# Altium schematic sheet SDCard.SchDoc: Iris
size A3; Organization: Toradex AG; Address1: Altsagenstrasse 5; Address2: Horw; Address3: 6048; Address4: Switzerland; DocumentNumber: 7; Revision: V2.0; SheetNumber: 7; SheetTotal: 16
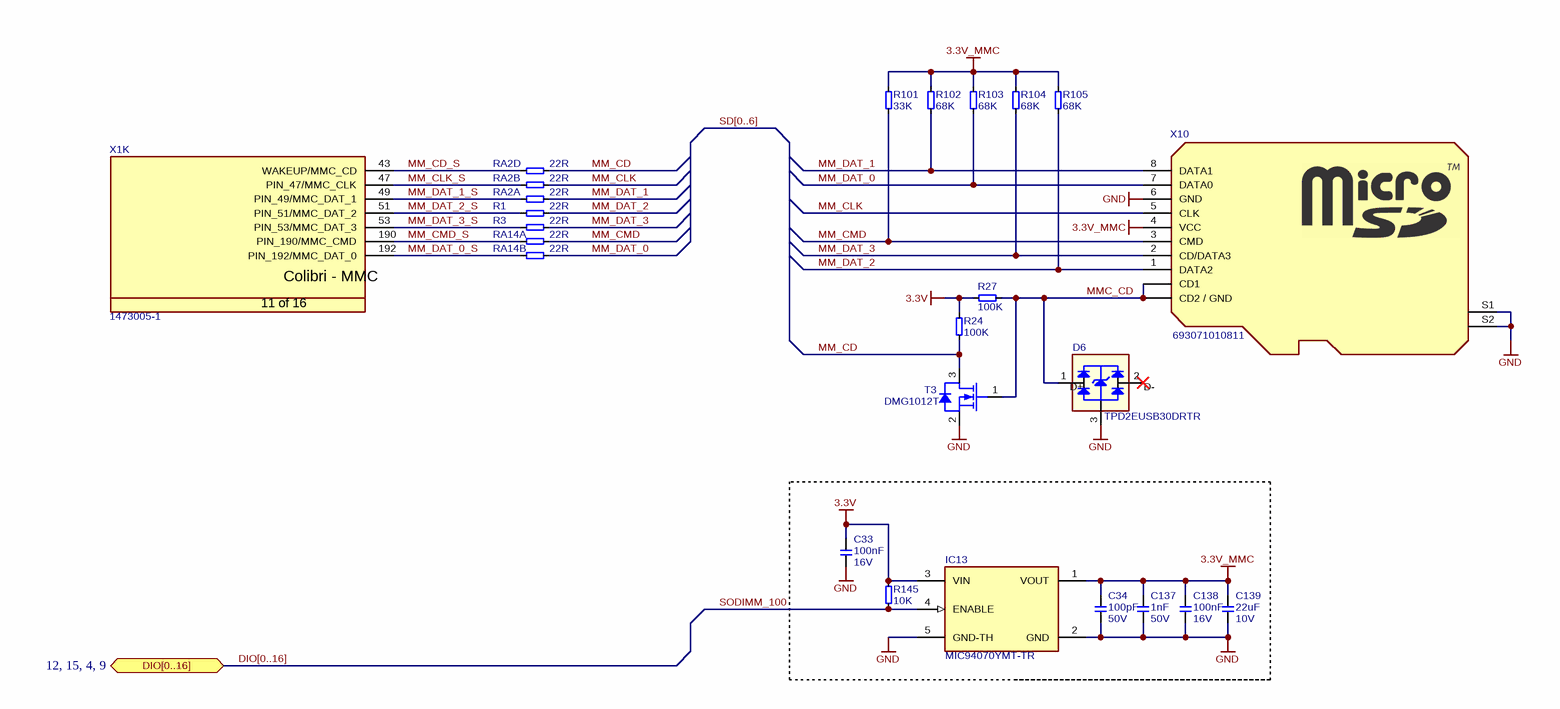
[diagram p0: SDCard.SchDoc]

## Parts
C33  Rating: 16V  [CAPC1005X60N]  (hidden comment: 100nF)
C34  Rating: 50V  [CAPC1005X60N]  (hidden comment: 100pF)
C137  Rating: 50V  [CAPC1005X60N]  (hidden comment: 1nF)
C138  Rating: 16V  [CAPC1005X60N]  (hidden comment: 100nF)
C139  Rating: 10V  [T_CAPC0805X125N]  (hidden comment: 22uF)
D6  TPD2EUSB30DRTR  [T_TI_TPD2EUSB30DRTR]
IC13  MIC94070YMT-TR  [T_TDFN0P120X160X60-4N]
R1  22R  [RESC1005X40N]
R3  22R  [RESC1005X40N]
R24  100K  [T_RESC0603X30N]
R27  100K  [T_RESC0603X30N]
R101  33K  [RESC1005X40N]
R102  68K  [RESC1005X40N]
R103  68K  [RESC1005X40N]
R104  68K  [RESC1005X40N]
R105  68K  [RESC1005X40N]
R145  10K  [T_RESC0603X30N]
RA2  22R  [T_Resistor_Array_X4]  (parts A,B,D of 4)
RA14  22R  [T_Resistor_Array_X4]  (parts A,B of 4)
T3  Manufacturer Part No.: DMG1012T  [T_SOT50P160X80-3N]  (hidden comment: T-DiodeInc-DMG1012T)
X1  1473005-1  [T_Tyco_1473005-1]  (part K of 16)
X10  Manufacturer Part No.: 693071010811  [T_Wurth_693071010811]  (hidden comment: MicroSD Holder)

## Ports
DIO[0..16] (bidir, see 12, 15, 4, 9)

## Nets
3.3V: C33.2 IC13.3(VIN) R24.2 R27.2 R145.2
3.3V_MMC: C34.2 C137.2 C138.2 C139.2 IC13.1(VOUT) R101.2 R102.2 R103.2 R104.2 R105.2 X10.4(VCC)
GND: C33.1 C34.1 C137.1 C138.1 C139.1 D6.3 IC13.2(GND) IC13.5(GND-TH) T3.2(S) X10.6(GND) X10.S1(S) X10.S2(S)
MM_CD: R24.1 RA2.8 T3.3(D)
MM_CD_S: RA2.4 X1.43(WAKEUP/MMC_CD)
MM_CLK: RA2.6 X10.5(CLK)
MM_CLK_S: RA2.2 X1.47(PIN_47/MMC_CLK)
MM_CMD: R101.1 RA14.5 X10.3(CMD)
MM_CMD_S: RA14.1 X1.190(PIN_190/MMC_CMD)
MM_DAT_0: R103.1 RA14.6 X10.7(DATA0)
MM_DAT_0_S: RA14.2 X1.192(PIN_192/MMC_DAT_0)
MM_DAT_1: R102.1 RA2.5 X10.8(DATA1)
MM_DAT_1_S: RA2.1 X1.49(PIN_49/MMC_DAT_1)
MM_DAT_2: R1.2 R105.1 X10.1(DATA2)
MM_DAT_2_S: R1.1 X1.51(PIN_51/MMC_DAT_2)
MM_DAT_3: R3.2 R104.1 X10.2(CD/DATA3)
MM_DAT_3_S: R3.1 X1.53(PIN_53/MMC_DAT_3)
MMC_CD: D6.1(D+) R27.1 T3.1(G) X10.CD1 X10.CD2(CD2_/_GND)
SODIMM_100: IC13.4(ENABLE) R145.1

Not connected (* = marked no-connect by the designer): D6 2(D-)*

## Buses and harness runs
bus DIO[0..16] = port DIO[0..16]
bus SD[0..6]

## Notes on the sheet
- Title
- Size:
- Date:
- A3
- Number:
- Time:
- Revision:
- Sheet
- of
- File:
- (in symbol CON-Tyco-1473005-1-200-0.6mm, part K) Colibri - MMC; 11 of 16

## Library data of the parts
C33 C138 = C-X7R-100nF-16V-10%-0402: Capacitor Ceramic X7R 100nF 16V 10% 0402; Tolerance: 10%; Type: X7R; Value: 100nF
C34 = C-X7R-100pF-50V-10%-0402: Capacitor Ceramic X7R 100pF 50V 10% 0402; Tolerance: 10%; Type: X7R; Value: 100pF
C137 = C-X7R-1nF-50V-10%-0402: Capacitor Ceramic X7R 1nF 50V 10% 0402; Tolerance: 10%; Type: X7R; Value: 1nF
C139 = C-X5R-22uF-10V-20%-0805: Capacitor Ceramic X5R 22uF 10V 20% 0805; Tolerance: 20%; Type: X5R; Value: 22uF
D6 = D-TI-TPD2EUSB30DRTR: 2 Channel Protection for Super Speed USB3.0; Manufacturer Name: TI; Manufacturer Part No.: TPD2EUSB30DRTR
IC13 = IC-Microchip-MIC94070YMT-TR: High Side Load Switch, TDFN4 1.2 x 1.6; Manufacturer Name: Microchip; Package: TDFN-4; Manufacturer Part No.: MIC94070YMT-TR
R1 R3 = R-22R-63mW-5%-0402: Resistor 22 ohm 63mW 5% 0402; Rating: 63mW; Tolerance: 5%; Value: 22R
R24 R27 = R-100KR-63mW-5%-0603: Resistor 100 Kohm 63mW 5% 0603; Value: 100KR; Rating: 63mW; Tolerance: 5%
R101 = R-33KR-63mW-5%-0402: Resistor 33 Kohm 63mW 5% 0402; Value: 33KR; Rating: 63mW; Tolerance: 5%
R102-R105 = R-68KR-63mW-5%-0402: Resistor 68 Kohm 63mW 5% 0402; Value: 68KR; Rating: 63mW; Tolerance: 5%
R145 = R-10KR-63mW-5%-0603: Resistor 10 Kohm 63mW 5% 0603; Value: 10KR; Rating: 63mW; Tolerance: 5%
RA2 RA14 = RA-22R-63mW-5%-1206-div: Resistor Array 22 R 63mW 5% 1206; Manufacturer Name: Generic; Tolerance: 5%; Power Dissipation: 63mW; Manufacturer Part Number: *; Value: 22R
T3 = T-DiodeInc-DMG1012T: N-Channel 20V (D-S)  MOSFET; Manufacturer Name: Diode Inc
X1 = CON-Tyco-1473005-1-200-0.6mm: SODIMM Connector; Manufacturer Name: Tyco; No. of ways: 200; Manufacturer Part No.: 1473005-1
X10 = CON-Wurth-693071010811: Micro SD Holder Push Push CD; Manufacturer Name: Wurth; No. of ways: 9